# Altium schematic sheet Preamp.SchDoc
size A
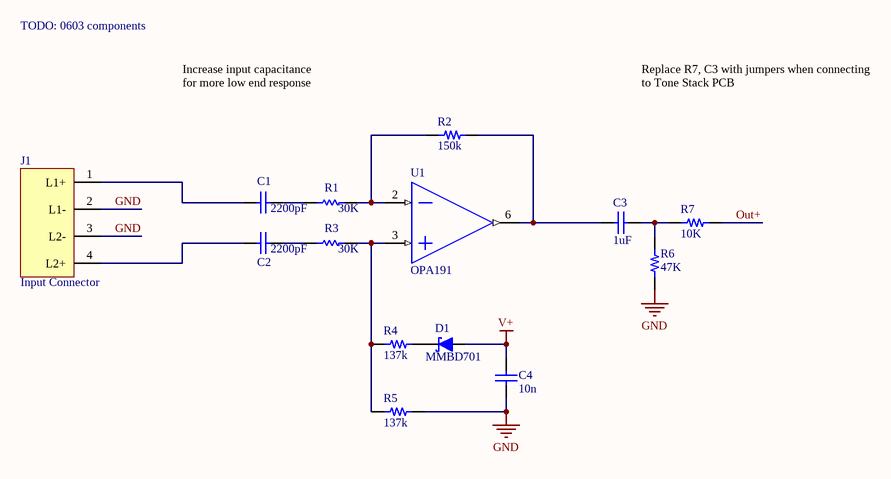
[diagram p0: Preamp.SchDoc]

## Parts
C1  2200pF  [CAPC1608X09N]
C2  2200pF  [CAPC1608X09N]
C3  1uF  [CAPC2012X09N]
C4  10n  [CAPC2012X09N]
D1  MMBD701  [SOT95P230X110-3N]
J1  Input Connector  [SM04B - all pins]
R1  30K  [RESC1608X06N]
R2  150k  [RESC2012X06N]
R3  30K  [RESC1608X06N]
R4  137k  [RESC2012X06N]
R5  137k  [RESC2012X06N]
R6  47K  [RESC2012X06N]
R7  10K  [RESC2012X06N]
U1  OPA191  [SOIC127P600X175-8N]

## Nets
GND: C4.1 J1.2(L1-) J1.3(L2-) R5.2 R6.1 U1.4(V-)
V+: C4.2 D1.1 U1.7(V+)
Out+: R7.1
NetC1_1: C1.1 J1.1(L1+)
NetC1_2: C1.2 R1.1
NetC2_1: C2.1 J1.4(L2+)
NetC2_2: C2.2 R3.1
NetC3_1: C3.1 R2.2 U1.6(Out)
NetC3_2: C3.2 R6.2 R7.2
NetD1_3: D1.3 R4.2
NetR1_2: R1.2 R2.1 U1.2(-IN)
NetR3_2: R3.2 R4.1 R5.1 U1.3(+IN)

## Notes on the sheet
- TODO: 0603 components
- Increase input capacitance for more low end response
- Replace R7, C3 with jumpers when connecting to Tone Stack PCB

## Library data of the parts
C1 C2 = CAP CER 2200pF 0603: Manufacturer: Murata; Voltage: 50V; Tolerance: 1%; Rating: C0G; Value: 2200pF; Digikey Part Number: 490-7768-1-ND
C3 = CAP 1uF 0805: Rating: X7R; Value: 1uF
C4 = CAP 0805: Value: 10n
D1 = MMBD701: SOT-23 Schottky Diode; Type: SCHOT; Voltage: 40V; Footprint: DO-214AC; Digikey Part Number: SS14-E3/61TGICT-ND; Manufacturer Part Number: MMBD701
R1 R3 = RES 30K 0603: Tolerance: 1%; Type: RES; Footprint: 0603; Digikey Part Number: 311-30.0KHRCT-ND; Value: 30K
R2 R4 R5 = RES 0805: Tolerance: 1%; Type: RES; Footprint: 0805
  R2: Value: 150k
  R4 R5: Value: 137k
R6 = RES 47K 0805: Tolerance: 1%; Type: RES; Footprint: 0805; Value: 47K
R7 = RES 10K 0805: Tolerance: 1%; Type: RES; Footprint: 0805; Value: 10K
U1 = OPA191_SOIC: Low Power CMOS Amp; Manufacturer: Texas Instruments; Digikey Part Number: 296-43805-1-ND; Amplifier: Low Power